# EAGLE schematic shield (EAGLE 9.6.2)
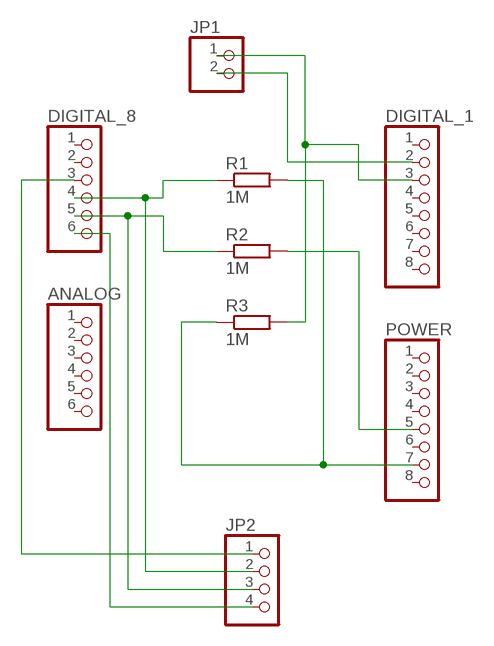
[diagram p0: schematic, sheet 1]

## Parts
ANALOG  PINHD-1X6  [1X06]
DIGITAL_1  PINHD-1X8  [1X08]
DIGITAL_8  PINHD-1X6  [1X06]
JP1  PINHD-1X2  [1X02]
JP2  PINHD-1X4  [1X04]
POWER  PINHD-1X8  [1X08]
R1  1M  R-EU_0207/10  [0207/10]
R2  1M  R-EU_0207/10  [0207/10]
R3  1M  R-EU_0207/10  [0207/10]

## Nets
N$1: POWER.7 R1.2 R3.1
N$2: DIGITAL_8.4 JP2.2 R1.1
N$3: DIGITAL_8.5 JP2.3 R2.1
N$4: POWER.5 R2.2
N$5: DIGITAL_1.3 JP1.1 R3.2
N$6: DIGITAL_8.6 JP2.4
N$7: DIGITAL_8.3 JP2.1
N$8: DIGITAL_1.2 JP1.2
Unconnected: ANALOG.1 ANALOG.2 ANALOG.3 ANALOG.4 ANALOG.5 ANALOG.6 DIGITAL_1.1 DIGITAL_1.4 DIGITAL_1.5 DIGITAL_1.6 DIGITAL_1.7 DIGITAL_1.8 DIGITAL_8.1 DIGITAL_8.2 POWER.1 POWER.2 POWER.3 POWER.4 POWER.6 POWER.8

## Library data of the parts
ANALOG DIGITAL_8 = pinhead:PINHD-1X6: PIN HEADER
DIGITAL_1 POWER = pinhead:PINHD-1X8: PIN HEADER
JP1 = pinhead:PINHD-1X2: PIN HEADER
JP2 = pinhead:PINHD-1X4: PIN HEADER
R1-R3 = rcl:R-EU_: RESISTOR, European symbol; SPICEPREFIX: R